# Altium schematic sheet EIS_Sensoren_V1_1.SchDoc: EIS: CO2 / Temp / Feuchte / Druck / Licht
size A4; Organization: Hahn-Schickard; Address1: Wilhelm-Schickard-Str. 10; Address2: 78052 Villingen-Schwenningen; Address3: Bernd.Ehrbrecht@Hahn-Schickard.de; DocumentNumber: 1; Revision: 1.1; SheetNumber: 1; SheetTotal: 2; PhoneNumber: 0 7721 943 137; E-Mail: Bernd.Ehrbrecht@Hahn-Schickard.de; ProjectName: Project File Name
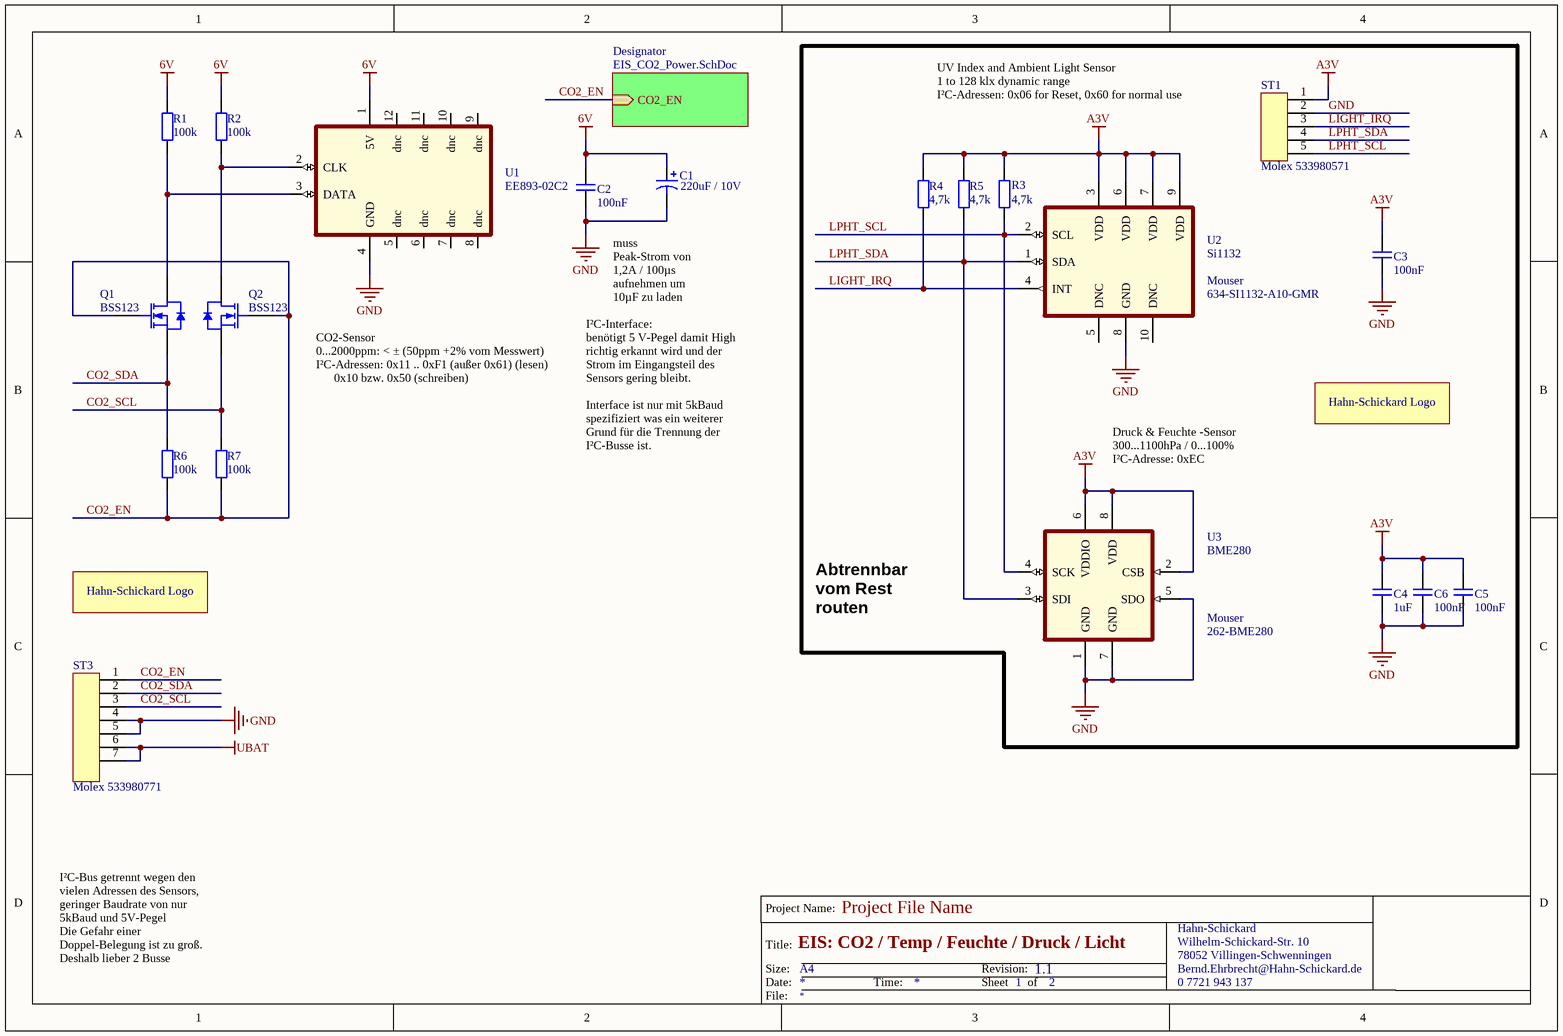
[diagram p0: EIS_Sensoren_V1_1.SchDoc]

## Parts
C1  220uF / 10V  [D]
C2  100nF  [CAPC1608N]
C3  100nF  [CAPC1608N]
C4  1uF  [CAPC3216N]
C5  100nF  [CAPC1608N]
C6  100nF  [CAPC1608N]
LOGO1  Hahn-Schickard LOGO  [Hahn-Schickard-LOGO_klein]  (value not drawn)
LOGO2  Hahn-Schickard LOGO  [Hahn-Schickard-LOGO_klein]  (value not drawn)
Q1  BSS123  [SOT23_N - BSS123]
Q2  BSS123  [SOT23_N - BSS123]
R1  100k  [RESC1608N]
R2  100k  [RESC1608N]
R3  4,7k  [RESC1608N]
R4  4,7k  [RESC1608N]
R5  4,7k  [RESC1608N]
R6  100k  [RESC1608N]
R7  100k  [RESC1608N]
ST1  Molex 533980571  [Molex 533980571]
ST3  Molex 533980771  [Molex 533980771]
U1  EE893-02C2  [EE893]
U2  Si1132  Supplier 1: Mouser  Supplier Part Number 1: 634-SI1132-A10-GMR  [Si1132]
U3  BME280  Supplier 1: Mouser  Supplier Part Number 1: 262-BME280  [BME280]

## Sub-sheets
Designator = EIS_CO2_Power.SchDoc: CO2_EN (in)

## Nets
6V: C1.1 C2.1 R1.2 R2.2 U1.1(5V)
A3V: C3.1 C4.1 C5.1 C6.1 R3.2 R4.2 R5.2 ST1.1 U2.3(VDD) U2.6(VDD) U2.7(VDD) U2.9(VDD) U3.2(CSB) U3.6(VDDIO) U3.8(VDD)
GND: C1.2 C2.2 C3.2 C4.2 C5.2 C6.2 ST1.2 ST3.4 ST3.5 U1.4(GND) U2.8(GND) U3.1(GND) U3.5(SDO) U3.7(GND)
UBAT: ST3.6 ST3.7
CO2_EN: Q1.1(G) Q2.1(G) R6.1 R7.1 ST3.1 ; sheet Designator/CO2_EN
CO2_SCL: Q2.2(S) R7.2 ST3.3
CO2_SDA: Q1.2(S) R6.2 ST3.2
LIGHT_IRQ: R4.1 ST1.3 U2.4(INT)
LPHT_SCL: R3.1 ST1.5 U2.2(SCL) U3.4(SCK)
LPHT_SDA: R5.1 ST1.4 U2.1(SDA) U3.3(SDI)
NetQ1_3: Q1.3(D) R1.1 U1.3(DATA)
NetQ2_3: Q2.3(D) R2.1 U1.2(CLK)

Not connected (* = marked no-connect by the designer): ST1 6 7; ST3 8 9; U1 5(dnc) 6(dnc) 7(dnc) 8(dnc) 9(dnc) 10(dnc) 11(dnc) 12(dnc); U2 5(DNC) 10(DNC)

## Notes on the sheet
- UV Index and Ambient Light Sensor
  1 to 128 klx dynamic range
  I²C-Adressen: 0x06 for Reset, 0x60 for normal use
- muss Peak-Strom von 1,2A / 100µs
  aufnehmen um 10µF zu laden
- CO2-Sensor
  0...2000ppm: < ± (50ppm +2% vom Messwert)
  I²C-Adressen: 0x11 .. 0xF1 (außer 0x61) (lesen)
  0x10 bzw. 0x50 (schreiben)
- I²C-Interface:
  benötigt 5 V-Pegel damit High richtig erkannt wird und der Strom im Eingangsteil des Sensors gering bleibt.
  Interface ist nur mit 5kBaud spezifiziert was ein weiterer Grund für die Trennung der I²C-Busse ist.
- Druck & Feuchte -Sensor
  300...1100hPa / 0...100%
  I²C-Adresse: 0xEC
- Abtrennbar vom Rest routen
- I²C-Bus getrennt wegen den vielen Adressen des Sensors, geringer Baudrate von nur 5kBaud und 5V-Pegel
  Die Gefahr einer Doppel-Belegung ist zu groß. Deshalb lieber 2 Busse
- Project Name:
- Size:
- Date:
- Title:
- A4
- Time:
- Revision:
- Sheet
- of
- File:
- (in symbol Hahn-Schickard LOGO) Hahn-Schickard Logo

## Library data of the parts
C1 = Cap Pol3: Polarized Capacitor (Surface Mount); Published: 8-Jun-2000; LatestRevisionDate: 17-Jul-2002; LatestRevisionNote: Re-released for DXP Platform.; PackageReference: C0805; Publisher: Altium Limited; Value: 220uF / 10V
C2-C6 = Kondensator SMD Keramik
  C2 C3 C5 C6: Value: 100nF
  C4: Value: 1uF
LOGO1 LOGO2 = Hahn-Schickard LOGO: Hahn-Schickard Logo als Footprint
Q1 Q2 = BSS123: N-channel Enhancement Mode Vertical D-MOSFET; Published: 17-Sep-2003; LatestRevisionDate: 12-Dec-2006; LatestRevisionNote: IPC-7351 Footprint Added.; DatasheetVersion: Apr-1995; PackageVersion: May-1999; PackageReference: SOT23; Publisher: Altium Limited; PackageDescription: 3-Pin SOT-23 Package 0.95 mm Pitch, 2.3 mm Lead Span; ComponentLink1Description: Manufacturer Link; ComponentLink1URL: http://www.semiconductors.philips.com/; ComponentLink2Description: Datasheet; ComponentLink2URL: http://www.semiconductors.philips.com/acrobat/datasheets/BSS123_3.pdf
R1-R7 = RESC1608 (R0603): Suplier: Seller; Suplier Ordering Number: Ordering Number; Published: 14.08.2009; Publisher: HSG Jürgen Merz; ComponentLink1Description: RESC1608 (R0603) 1%
  R1 R2 R6 R7: Value: 100k
  R3-R5: Value: 4,7k
ST1 = Molex 533980571: MOLEX - 53398-0571 - STIFTLEISTE, SMT, 1.25MM, 5POL; Supplier 1: Farnell; Supplier Part Number 1: 2426364
ST3 = Molex 533980771: Molex Pico 7Pol Blade SMD gerade 533980771; Supplier 1: Farnell
U1 = EE893-02C2: CO2-Sensor; I²C-Interface,
U2 = Si1132: UV INDEX AND AMBIENT LIGHT SENSOR IC WITH I2C INTERFACE, QFN 2x2mm
U3 = BME280: Bosch, Druck & Feuchte-Sensor, I2C / SPI